# EAGLE design SignalGenerator (EAGLE 6.5.0)
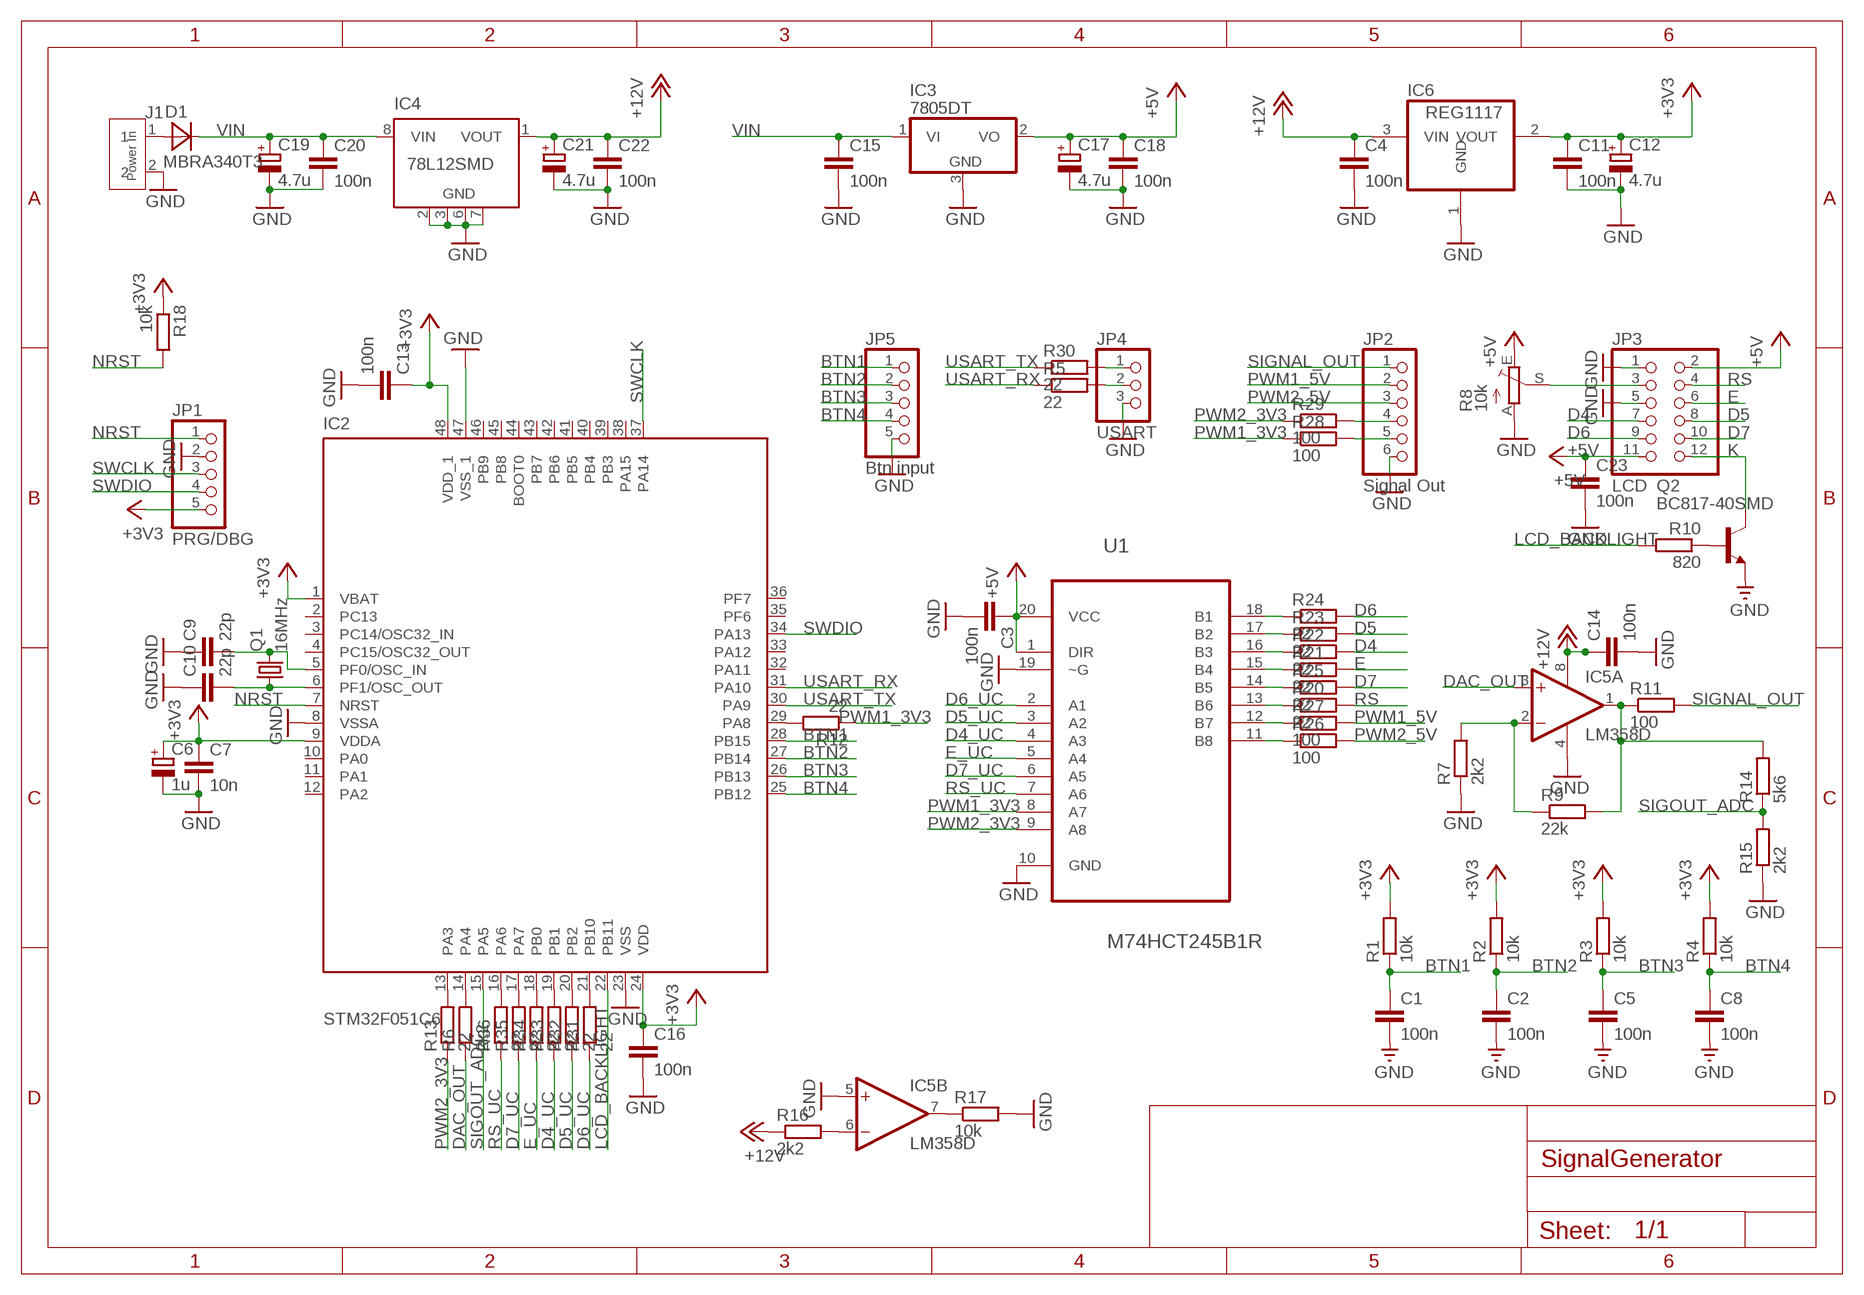
[diagram p0: schematic, sheet 1]

## Parts
C1  100n  C-EUC0805  [C0805]
C2  100n  C-EUC0805  [C0805]
C3  100n  C-EUC0805  [C0805]
C4  100n  C-EUC0805  [C0805]
C5  100n  C-EUC0805  [C0805]
C6  1u  CPOL-EUA/3216-18W  [A/3216-18W]
C7  10n  C-EUC0805  [C0805]
C8  100n  C-EUC0805  [C0805]
C9  22p  C-EUC0603  [C0603]
C10  22p  C-EUC0603  [C0603]
C11  100n  C-EUC0805  [C0805]
C12  4.7u  CPOL-EUA  [PANASONIC_A]
C13  100n  C-EUC0805  [C0805]
C14  100n  C-EUC0805  [C0805]
C15  100n  C-EUC0805  [C0805]
C16  100n  C-EUC0805  [C0805]
C17  4.7u  CPOL-EUB  [PANASONIC_B]
C18  100n  C-EUC0805  [C0805]
C19  4.7u  CPOL-EUB  [PANASONIC_B]
C20  100n  C-EUC0805  [C0805]
C21  4.7u  CPOL-EUA  [PANASONIC_A]
C22  100n  C-EUC0805  [C0805]
C23  100n  C-EUC0805  [C0805]
D1  MBRA340T3  [SMA]
IC2  STM32F051C6  [LQFP48-7X7]
IC3  7805DT  [TO252]
IC4  78L12SMD  [SO08]
IC5  LM358D  [SO08]
IC6  REG1117  [SOT223]
J1  Power In  SCREW-TERMINAL-2P'5.08'  [2P-5.08]
JP1  PRG/DBG  PINHD-1X5  [1X05]
JP2  Signal Out  PINHD-1X6  [1X06]
JP3  LCD  PINHD-2X6  [2X06]
JP4  USART  PINHD-1X3  [1X03]
JP5  Btn input  PINHD-1X5  [1X05]
Q1  16MHz  SMD_CRYSTAL  [SMD_CRYSTAL]
Q2  BC817-40SMD  [SOT23-BEC]
R1  10k  R-EU_R0603  [R0603]
R2  10k  R-EU_R0603  [R0603]
R3  10k  R-EU_R0603  [R0603]
R4  10k  R-EU_R0603  [R0603]
R5  22  R-EU_R0603  [R0603]
R6  2k2  R-EU_R0603  [R0603]
R7  2k2  R-EU_R0603  [R0603]
R8  10k  TRIM_EU-B25P  [B25P]
R9  22k  R-EU_R0603  [R0603]
R10  820  R-EU_R0603  [R0603]
R11  100  R-EU_R0603  [R0603]
R12  22  R-EU_R0603  [R0603]
R13  22  R-EU_R0603  [R0603]
R14  5k6  R-EU_R0603  [R0603]
R15  2k2  R-EU_R0603  [R0603]
R16  2k2  R-EU_R0603  [R0603]
R17  10k  R-EU_R0603  [R0603]
R18  10k  R-EU_R0603  [R0603]
R20  22  R-EU_R0603  [R0603]
R21  22  R-EU_R0603  [R0603]
R22  22  R-EU_R0603  [R0603]
R23  22  R-EU_R0603  [R0603]
R24  22  R-EU_R0603  [R0603]
R25  22  R-EU_R0603  [R0603]
R26  100  R-EU_R0603  [R0603]
R27  100  R-EU_R0603  [R0603]
R28  100  R-EU_R0603  [R0603]
R29  100  R-EU_R0603  [R0603]
R30  22  R-EU_R0603  [R0603]
R31  22  R-EU_R0603  [R0603]
R32  22  R-EU_R0603  [R0603]
R33  22  R-EU_R0603  [R0603]
R34  22  R-EU_R0603  [R0603]
R35  22  R-EU_R0603  [R0603]
R36  22  R-EU_R0603  [R0603]
U1  M74HCT245B1R  [DIP254P762X393-20]

## Nets
+3V3: C6.+ C7.1 C11.1 C12.+ C13.1 C16.1 IC2.1(VBAT) IC2.9(VDDA) IC2.24(VDD) IC2.48(VDD_1) IC6.2(VOUT) JP1.5 R1.2 R2.2 R3.2 R4.2 R18.1
+5V: C3.1 C17.+ C18.1 C23.1 IC3.2(VO) JP3.2 JP3.11 R8.E U1.1(DIR) U1.20(VCC)
+12V: C4.1 C14.1 C21.+ C22.1 IC4.1(VOUT) IC5.8(P:V+) IC6.3(VIN) R16.1
BTN1: C1.1 IC2.28(PB15) JP5.1 R1.1
BTN2: C2.1 IC2.27(PB14) JP5.2 R2.1
BTN3: C5.1 IC2.26(PB13) JP5.3 R3.1
BTN4: C8.1 IC2.25(PB12) JP5.4 R4.1
D4: JP3.7 R22.2
D4_UC: R33.1 U1.4(A3)
D5: JP3.8 R23.2
D5_UC: R32.1 U1.3(A2)
D6: JP3.9 R24.2
D6_UC: R31.1 U1.2(A1)
D7: JP3.10 R25.2
D7_UC: R35.1 U1.6(A5)
DAC_OUT: IC5.3(A:+IN) R6.1
E: JP3.6 R21.2
E_UC: R34.1 U1.5(A4)
GND: C1.2 C2.2 C3.2 C4.2 C5.2 C6.- C7.2 C8.2 C9.1 C10.1 C11.2 C12.- C13.2 C14.2 C15.2 C16.2 C17.- C18.2 C19.- C20.2 C21.- C22.2 C23.2 IC2.8(VSSA) IC2.23(VSS) IC2.47(VSS_1) IC3.3(GND) IC4.2(GND) IC4.3(GND) IC4.6(GND) IC4.7(GND) IC5.4(P:V-) IC5.5(B:+IN) IC6.1(GND) J1.2 JP1.2 JP2.6 JP3.1 JP3.5 JP4.3 JP5.5 Q2.E R7.1 R8.A R15.1 R17.2 U1.10(GND) U1.19(~G)
K: JP3.12 Q2.C
LCD_BACKLIGHT: IC2.22(PB11) R10.2
N$1: C10.2 IC2.6(PF1/OSC_OUT) Q1.1
N$2: C9.2 IC2.5(PF0/OSC_IN) Q1.2
N$3: JP3.3 R8.S
N$5: Q2.B R10.1
N$6: IC5.2(A:-IN) R7.2 R9.1
N$7: IC2.14(PA4) R6.2
N$8: IC5.1(A:OUT) R9.2 R11.1 R14.2
N$9: IC2.29(PA8) R12.2
N$10: IC2.13(PA3) R13.2
N$11: JP2.5 R28.2
N$12: JP2.4 R29.2
N$13: IC2.16(PA6) R36.2
N$14: IC2.17(PA7) R35.2
N$15: IC2.18(PB0) R34.2
N$16: IC2.19(PB1) R33.2
N$17: R20.1 U1.13(B6)
N$18: R21.1 U1.15(B4)
N$19: R22.1 U1.16(B3)
N$20: R23.1 U1.17(B2)
N$21: R24.1 U1.18(B1)
N$22: R26.1 U1.11(B8)
N$23: R27.1 U1.12(B7)
N$24: R25.1 U1.14(B5)
N$25: JP4.1 R30.2
N$26: JP4.2 R5.2
N$28: IC2.20(PB2) R32.2
N$29: IC2.21(PB10) R31.2
N$30: D1.A J1.1
N$31: IC5.6(B:-IN) R16.2
N$32: IC5.7(B:OUT) R17.1
NRST: IC2.7(NRST) JP1.1 R18.2
PWM1_3V3: R12.1 R28.1 U1.8(A7)
PWM1_5V: JP2.2 R27.2
PWM2_3V3: R13.1 R29.1 U1.9(A8)
PWM2_5V: JP2.3 R26.2
RS: JP3.4 R20.2
RS_UC: R36.1 U1.7(A6)
SIGNAL_OUT: JP2.1 R11.2
SIGOUT_ADC: IC2.15(PA5) R14.1 R15.2
SWCLK: IC2.37(PA14) JP1.3
SWDIO: IC2.34(PA13) JP1.4
USART_RX: IC2.31(PA10) R5.1
USART_TX: IC2.30(PA9) R30.1
VIN: C15.1 C19.+ C20.1 D1.C IC3.1(VI) IC4.8(VIN)
Unconnected: IC2.2(PC13) IC2.3(PC14/OSC32_IN) IC2.4(PC15/OSC32_OUT) IC2.10(PA0) IC2.11(PA1) IC2.12(PA2) IC2.32(PA11) IC2.33(PA12) IC2.35(PF6) IC2.36(PF7) IC2.38(PA15) IC2.39(PB3) IC2.40(PB4) IC2.41(PB5) IC2.42(PB6) IC2.43(PB7) IC2.44(BOOT0) IC2.45(PB8) IC2.46(PB9) IC4.4(NC) IC4.5(NC)

## Library data of the parts
C1-C5 C7-C11 C13-C16 C18 C20 C22 C23 = resistor:C-EU: CAPACITOR, European symbol
C6 C12 C17 C19 C21 = resistor:CPOL-EU: POLARIZED CAPACITOR, European symbol
D1 = diode:MBRA340T3: Surface Mount Schottky Power Rectifier Source: http://www.onsemi.com/pub_link/Collateral/MBRA340T3-D.PDF
IC2 = CarReceiver:STM32F051C6
IC3 = linear:78*: Positive VOLTAGE REGULATOR Source: http://cache.national.com/ds/LM/LM78L05.pdf http://www.fairchildsemi.com/ds/LM/LM7805.pdf
IC4 = linear:78L*SMD: Positive VOLTAGE REGULATOR
IC5 = linear:LM358: OP AMP also LM158; LM258; LM2904 Source: http://cache.national.com/ds/LM/LM158.pdf
IC6 = burr-brown:REG1117: 800mA and 1A Low Dropout (LDO) Positive Regulator 1.8V, 2.5V, 2.85V, 3.3V, 5V, and Adj; MPN: REG1117; OC_FARNELL: 1097566; OC_NEWARK: 14P6981
J1 = SeeedStudio-Connector:SCREW-TERMINAL-2P
JP1 JP5 = pinhead:PINHD-1X5: PIN HEADER
JP2 = pinhead:PINHD-1X6: PIN HEADER
JP3 = pinhead:PINHD-2X6: PIN HEADER
JP4 = pinhead:PINHD-1X3: PIN HEADER
Q1 = CarReceiver:SMD_CRYSTAL
Q2 = CarReceiver:BC817*: NPN Transistor
R1-R7 R9-R18 R20-R36 = resistor:R-EU_: RESISTOR, European symbol
R8 = pot:TRIM_EU-: POTENTIOMETER
U1 = ST Microelctronics_By_element14_Batch_1:M74HCT245B1R: OCTAL BUS TRANSCEIVER; MPN: M74HCT245B1R; OC_FARNELL: 1282842; OC_NEWARK: 89K0835; PACKAGE: PDIP-20; SUPPLIER: STMICROELECTRONICS

## Board
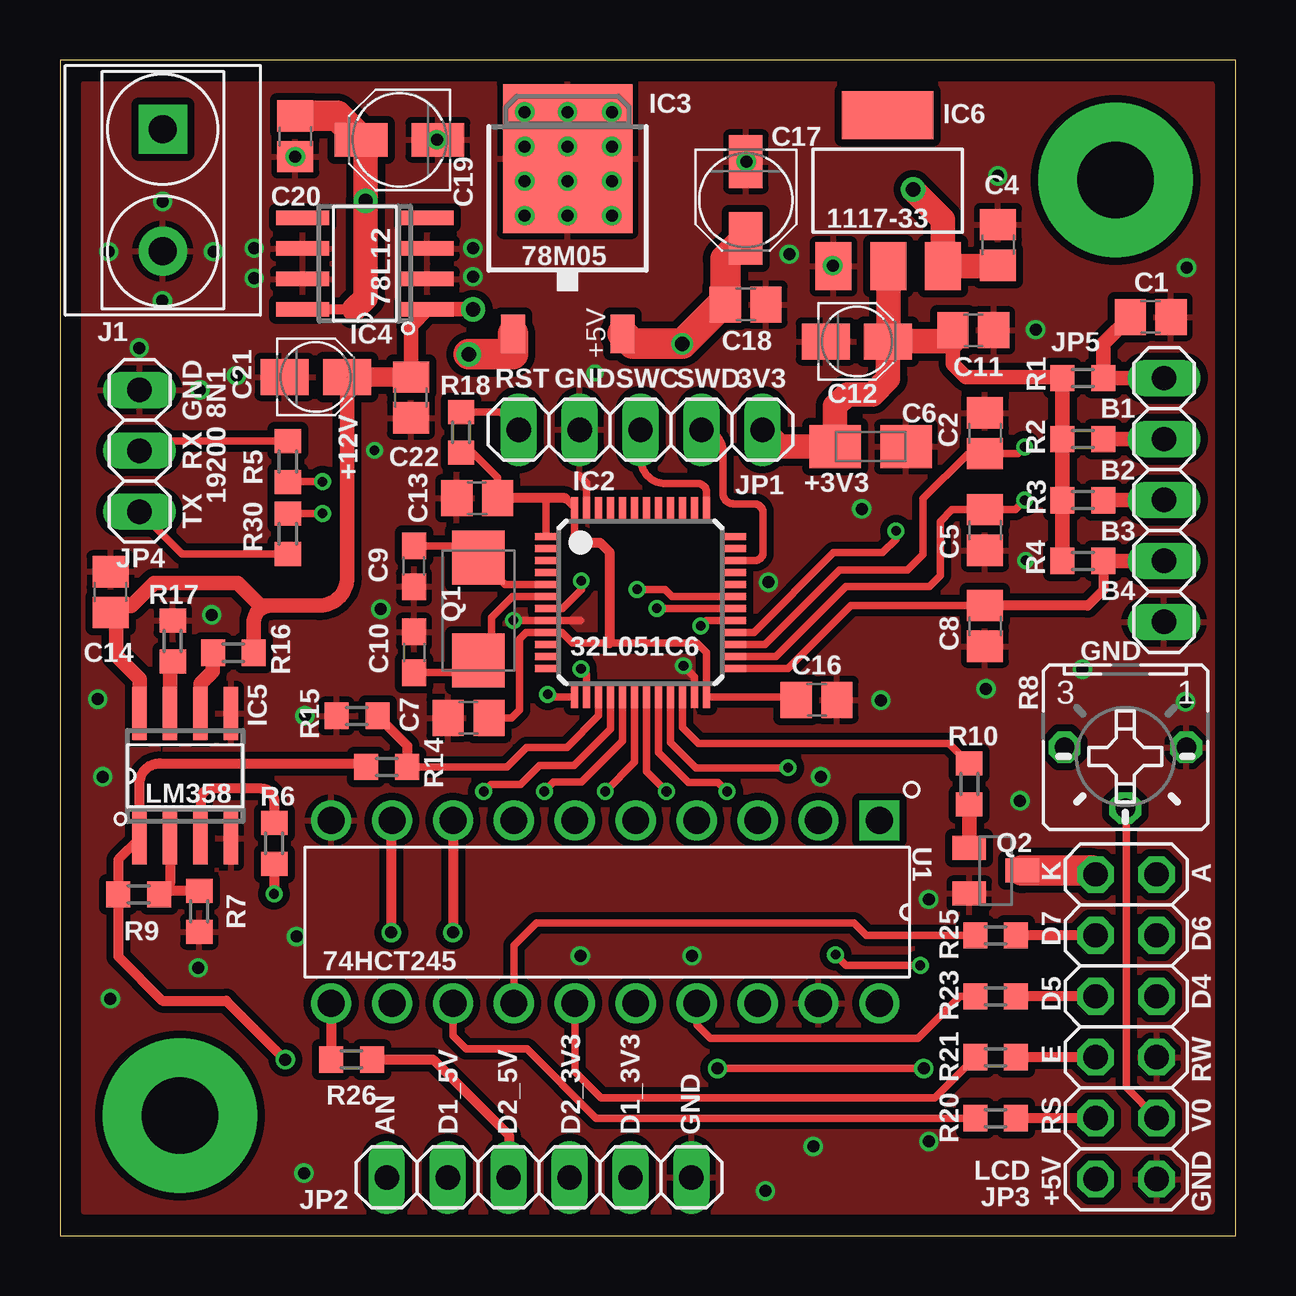
[diagram p1: board, top side]
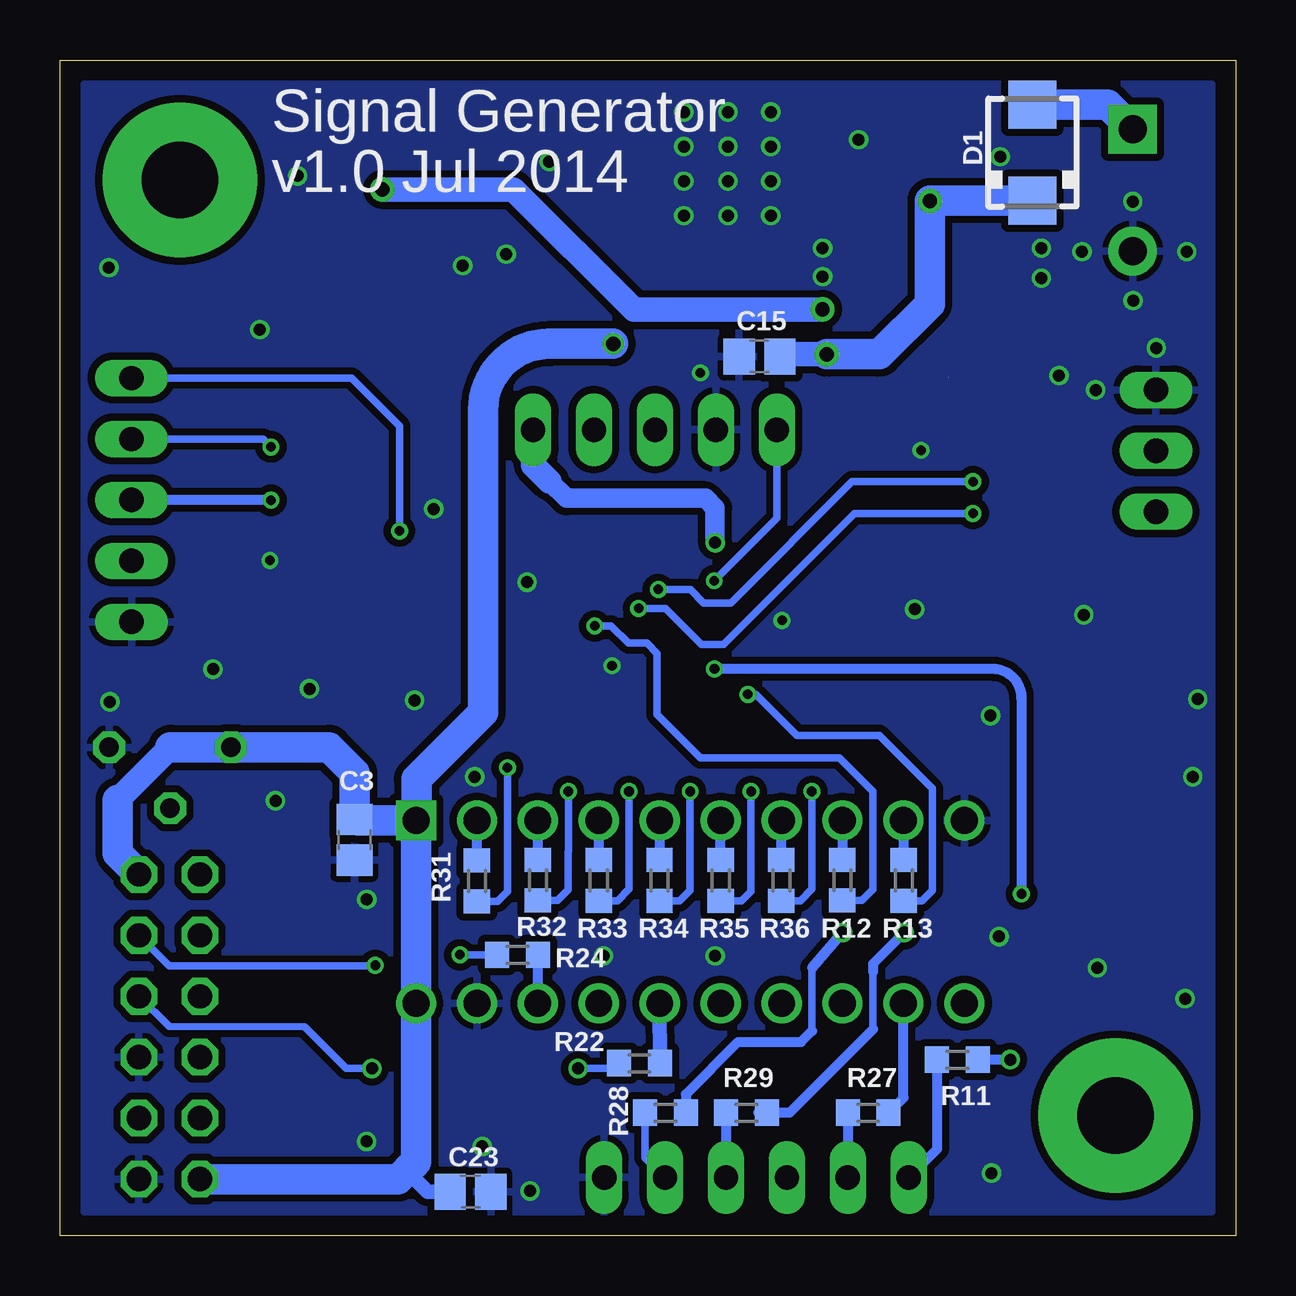
[diagram p2: board, bottom side, seen from below]

Size 49 x 49 mm. Coordinates in mm from the lower left corner, seen from the top.
Outline: 0,0 49,0 49,49 0,49 0,0
Copper layers (1*16): Top 0.035mm / dielectric 1.5mm / Bottom 0.035mm
Design rules "SeeedStudio_2layer_DRU_no_angle_20140221": minimum track width 6mil, minimum drill 12mil, track to track 6mil, track to pad 6mil, pad to pad 6mil, via to via 6mil, smd to smd 0mil, copper to edge 10mil, drill to drill 10mil, minimum pad ring 10mil, minimum via ring 6mil, stop-mask expansion 2mil, vias tented up to drill 100mil, thermal gap 10mil

### Footprints (pad centres in the part's own frame; a part is rotated, then mirrored left to right if it is on the bottom)
C0805 = smd 1.3 x 1.5: 1 -0.85,0; 2 0.85,0
A/3216-18W = smd 2.15 x 1.8: + 1.475,0; - -1.475,0
C0603 = smd 1.1 x 1: 1 -0.85,0; 2 0.85,0
PANASONIC_A = smd 2 x 1.5: + 1.3,0; - -1.3,0
PANASONIC_B = smd 2.2 x 1.4: + 1.6,0; - -1.6,0
SMA = smd 2 x 2: A 2,0; C -2,0
LQFP48-7X7 = smd 0.9 x 0.3: 1 -3.95,2.75; 2 -3.95,2.25; 3 -3.95,1.75; 4 -3.95,1.25; 5 -3.95,0.75; 6 -3.95,0.25; 7 -3.95,-0.25; 8 -3.95,-0.75; 9 -3.95,-1.25; 10 -3.95,-1.75; 11 -3.95,-2.25; 12 -3.95,-2.75; 25 3.95,-2.75; 26 3.95,-2.25; 27 3.95,-1.75; 28 3.95,-1.25; 29 3.95,-0.75; 30 3.95,-0.25; 31 3.95,0.25; 32 3.95,0.75; 33 3.95,1.25; 34 3.95,1.75; 35 3.95,2.25; 36 3.95,2.75 | smd 0.3 x 0.9: 13 -2.75,-3.95; 14 -2.25,-3.95; 15 -1.75,-3.95; 16 -1.25,-3.95; 17 -0.75,-3.95; 18 -0.25,-3.95; 19 0.25,-3.95; 20 0.75,-3.95; 21 1.25,-3.95; 22 1.75,-3.95; 23 2.25,-3.95; 24 2.75,-3.95; 37 2.75,3.95; 38 2.25,3.95; 39 1.75,3.95; 40 1.25,3.95; 41 0.75,3.95; 42 0.25,3.95; 43 -0.25,3.95; 44 -0.75,3.95; 45 -1.25,3.95; 46 -1.75,3.95; 47 -2.25,3.95; 48 -2.75,3.95
TO252 = smd 1 x 1.6: 1 -2.28,-4.8; 2 2.28,-4.8 | smd 5.4 x 6.2: 3 0,2.5
SO08 = smd 0.6 x 2.2: 1 -1.905,-2.6; 2 -0.635,-2.6; 3 0.635,-2.6; 4 1.905,-2.6; 5 1.905,2.6; 6 0.635,2.6; 7 -0.635,2.6; 8 -1.905,2.6
SOT223 = smd 1.499 x 2.007: 1 -2.261,-3.15; 2 0.025,-3.15; 3 2.311,-3.15 | smd 3.81 x 2.007: 4 0,3.15
2P-5.08 = drill 1.168 pad 2.032 square: 1 0,2.54 | drill 1.168 pad 2.032: 2 0,-2.54
1X05 = drill 1.016 long: 1 -5.08,0; 2 -2.54,0; 3 0,0; 4 2.54,0; 5 5.08,0
1X06 = drill 1.016 long: 1 -6.35,0; 2 -3.81,0; 3 -1.27,0; 4 1.27,0; 5 3.81,0; 6 6.35,0
2X06 = drill 1.016 octagon: 1 -6.35,-1.27; 2 -6.35,1.27; 3 -3.81,-1.27; 4 -3.81,1.27; 5 -1.27,-1.27; 6 -1.27,1.27; 7 1.27,-1.27; 8 1.27,1.27; 9 3.81,-1.27; 10 3.81,1.27; 11 6.35,-1.27; 12 6.35,1.27
1X03 = drill 1.016 long: 1 -2.54,0; 2 0,0; 3 2.54,0
SMD_CRYSTAL = smd 2.25 x 2.2: 1 -2.15,0; 2 2.15,0
SOT23-BEC = smd 1 x 1.4: B -0.95,-1.1; C 0,1.1; E 0.95,-1.1
R0603 = smd 1 x 1.1: 1 -0.85,0; 2 0.85,0
B25P = drill 0.813 octagon: A -2.54,0; E 2.54,0; S 0,2.54
DIP254P762X393-20 = drill 1.118 square: 1 -7.62,22.86 | drill 1.118: 2 -7.62,20.32; 3 -7.62,17.78; 4 -7.62,15.24; 5 -7.62,12.7; 6 -7.62,10.16; 7 -7.62,7.62; 8 -7.62,5.08; 9 -7.62,2.54; 10 -7.62,0; 11 0,0; 12 0,2.54; 13 0,5.08; 14 0,7.62; 15 0,10.16; 16 0,12.7; 17 0,15.24; 18 0,17.78; 19 0,20.32; 20 0,22.86

### Placement (x,y rotation side)
C1  45.46,38.29 0 top
C2  38.56,33.44 90 top
C3  36.72,16.5 270 bottom
C4  39.1,41.29 90 top
C5  38.56,29.41 270 top
C6  33.79,32.88 180 top
C7  17.03,21.58 180 top
C8  38.56,25.41 270 top
C9  14.75,27.9 90 top
C10  14.76,24.31 270 top
C11  38.07,37.73 0 top
C12  33.22,37.27 0 top
C13  17.39,30.73 180 top
C14  2.11,26.82 90 top
C15  19.84,36.64 180 bottom
C16  31.54,22.33 0 top
C17  28.59,43.16 270 top
C18  28.58,38.81 0 top
C19  14.15,45.67 180 top
C20  9.81,45.82 270 top
C21  10.66,35.79 0 top
C22  14.63,34.93 270 top
C23  31.89,1.83 0 bottom
D1  8.47,45.14 90 bottom
IC2  24.2,26.39 0 top
IC3  21.16,42.39 0 top
IC4  12.71,40.51 90 top
IC5  5.22,19.16 0 top
IC6  34.5,43.55 0 top
J1  4.29,43.57 0 top
JP1  24.2,33.59 0 top
JP2  19.97,2.42 0 top
JP3  44.44,8.7 90 top
JP4  3.32,32.71 90 top
JP5  46.02,30.66 270 top
Q1  17.44,26.11 90 top
Q2  39,15.21 270 top
R1  42.64,35.74 180 top
R2  42.64,33.2 180 top
R3  42.64,30.65 180 top
R4  42.64,28.12 180 top
R5  9.5,32.26 90 top
R6  8.93,16.35 270 top
R7  5.81,13.51 90 top
R8  44.41,20.35 180 top
R9  3.28,14.22 180 top
R10  37.9,18.82 90 top
R11  11.59,7.33 180 bottom
R12  16.39,14.81 270 bottom
R13  13.83,14.8 270 bottom
R14  13.62,19.53 180 top
R15  12.38,21.66 0 top
R16  7.23,24.29 180 top
R17  4.7,24.78 90 top
R18  16.72,33.48 90 top
R20  39,4.89 0 top
R21  39,7.43 0 top
R22  24.85,7.18 180 bottom
R23  39,9.97 0 top
R24  29.93,11.7 180 bottom
R25  39,12.51 0 top
R26  12.15,7.34 0 top
R27  15.31,5.12 180 bottom
R28  23.76,5.12 180 bottom
R29  20.39,5.12 180 bottom
R30  9.5,29.25 270 top
R31  31.62,14.78 270 bottom
R32  29.08,14.81 270 bottom
R33  26.54,14.8 270 bottom
R34  24.01,14.8 270 bottom
R35  21.46,14.8 270 bottom
R36  18.93,14.8 270 bottom
U1  11.3,9.68 270 top

### Tracks (layer width: path | path; a pad name or v marks a point on that pad's centre or on a via)
+3V3  (via drill 0.5)
  Top 0.305: 21.45,29.12 IC2.48 21.06,30.73 | C7.1 18.82,21.58 19.15,21.91 19.15,24.87 19.42,25.14 IC2.9 20.92,25.14 21.37,24.69 22.89,24.69 26.56,24.69 26.95,24.3 IC2.24 30.6,22.44 C16.1 | R18.1 17.2,32.63 18.24,31.59 C13.1 | IC2.1 20.25,30.73
  Top 0.406: 21.45,29.12 v21.69,28.88 22.51,28.88 22.9,28.49 22.9,24.7 22.89,24.69 | 21.06,30.73 20.25,30.73 C13.1
  Top 0.61: C11.1 37.22,36.32 37.75,35.79 41.74,35.79 R1.2 R2.2 R3.2 R4.2
  Top 0.813: C12.+
  Top 1.016: IC6.2 C12.+ | C12.+ 34.52,35.71 33.87,35.06 32.8,35.06 32.31,34.57 C6.+ 29.99,32.88 JP1.5 | C12.+ 37.22,37.27 C11.1
  Bottom 0.813: v21.69,28.88 21.69,30.32 22.1,30.73 27.89,30.73 28.59,31.43
  Bottom 1.016: 28.59,31.43 29.28,32.12 JP1.5
+5V  (via drill 0.6)
  Top 1.016: 27.58,38.81 C18.1
  Top 1.27: IC3.2 23.86,37.17 v25.94,37.17 27.58,38.81 | C17.+ 27.73,40.7 C18.1
  Bottom 0.61: C23.1 33.69,1.83 34.55,2.69
  Bottom 1.016: 34.14,17.32 U1.1 | 46.59,18.16 44.4,20.35 | 36.58,17.3 C3.1
  Bottom 1.27: v25.94,37.17 28.61,37.17 arc-90 31.36,34.42 31.36,21.81 34.14,19.03 34.14,17.32 | JP3.2 34.9,2.35 34.55,2.69 34.16,3.08 U1.20 U1.1 36.58,17.3 | 44.4,20.35 R8.E 37.78,20.35 36.71,19.28 C3.1 | 46.59,18.16 46.59,15.93 JP3.11
+12V  (via drill 0.6 pad 1.02)  (1 unrouted)
  Top 0.406: 14.73,35.78 C22.1
  Top 0.61: v17.21,38.6 arc-90 v17.22,38.6 v17.21,38.6 | C21.+ 11.97,27.42 arc-90 10.81,26.26 8.78,26.26 | C22.1 14.63,37.92 IC4.1 v17.21,38.6 | 12,35.75 arc90 C21.+ | 8.78,26.26 arc90 8.08,25.56 R16.1 | 8.78,26.26 8.34,26.26 7.4,27.2 3.93,27.2 2.97,26.24 2.38,26.24 C14.1 | 2.35,26.24 C14.1 | IC5.8 3.31,23.2 2.34,24.17 2.34,25.74 C14.1
  Top 0.813: C22.1 C21.+
  Top 1.016: C4.1 39.06,40.4 IC6.3 36.81,42.35 v35.56,43.6
  Bottom 1.016: v35.56,43.6 30.09,43.6 25.08,38.59 v17.23,38.59 v17.22,38.6
BTN1  (via drill 0.4)
  Top 0.305: IC2.28 28.92,25.14 32.24,28.46 34.29,28.46 34.85,29.02 v34.85,29.37
  Top 0.61: JP5.1 R1.1 43.49,37.17 C1.1
  Bottom 0.305: JP5.1 38.07,35.74 38.06,35.73 36.84,35.73 34.85,33.74 v34.85,29.37
BTN2  (via drill 0.4)
  Top 0.305: IC2.27 29.38,24.64 32.48,27.74 35.33,27.74 35.97,28.38 35.97,30.71 37.82,32.56 38.53,32.56 C2.1 39.93,32.59 v40.21,32.87
  Top 0.61: JP5.2 R2.1
  Bottom 0.305: v40.21,32.87 40.54,33.2 JP5.2
BTN3  (via drill 0.4)
  Top 0.305: IC2.26 29.84,24.14 32.75,27.05 36.23,27.05 36.69,27.51 36.69,29.77 37.18,30.26 C5.1 39.82,30.26 v40.21,30.65
  Top 0.61: JP5.3 R3.1
  Bottom 0.406: v40.21,30.65 JP5.3
BTN4
  Top 0.305: IC2.25 30.34,23.64 32.96,26.26 C8.1
  Top 0.406: R4.1 43.49,26.91 42.84,26.26 C8.1
  Top 0.61: JP5.4 R4.1
D4  (via drill 0.5)
  Top 0.305: v36,6.96 v27.41,6.96
  Bottom 0.305: JP3.7 44.44,8.71 38.81,8.7 37.07,6.96 v36,6.96 | v27.41,6.96 25.92,6.96 R22.2
D4_UC
  Bottom 0.406: R33.1 U1.4
D5
  Top 0.406: JP3.8 R23.2
D5_UC
  Bottom 0.406: R32.1 U1.3
D6  (via drill 0.4)
  Top 0.305: v35.86,11.26 32.77,11.26 v32.33,11.7
  Bottom 0.305: JP3.9 44.44,11.25 v35.87,11.25 arc-90 v35.86,11.26 | R24.2 v32.33,11.7
D6_UC
  Bottom 0.406: R31.1 U1.2
D7
  Top 0.406: JP3.10 R25.2
D7_UC
  Bottom 0.406: R35.1 U1.6
DAC_OUT
  Top 0.406: R6.1 8.93,18.1 arc90 8.4,18.63 6.35,18.63 arc90 5.86,18.14 IC5.3 arc-90 IC5.3
E
  Top 0.406: JP3.6 R21.2
E_UC
  Bottom 0.406: R34.1 U1.5
GND  (via drill 0.4, 0.5)
  Top 0.305: IC2.47 21.95,31.39 21.66,31.68 | 21.69,25.64 IC2.8 v18.9,25.64 | IC2.23 26.45,23.29 v25.99,23.75
  Top 0.406: IC5.5
  other vias: 8.09,41.16 8.09,39.91 17.21,41.16 17.21,39.97 19.37,45.39 21.16,45.39 23,45.39 19.37,43.95 21.16,43.95 23,43.95 19.37,42.51 21.16,42.51 23,42.51 32.21,40.43 29.41,1.86 31.4,3.71 36.22,3.92 36.21,14.01 26.34,11.66 21.69,11.66 2.1,9.87 5.76,11.16 1.78,19.12 1.57,22.36 10.17,2.6 13.11,32.73 28.61,44.77 40.67,37.76 42.62,23.61 34.22,22.31 5.83,35.25 15.71,45.68 31.71,19.12 29.53,27.23 33.42,30.29 40.02,18.12 13.37,26.11 39.09,44.17 2.03,41.01 9.81,44.97 4.27,38.97 6.4,41.01 4.28,43.1 30.4,40.91 38.6,22.79 46.92,22.25 9.86,12.46 3.3,37 7.36,35.84 46.96,40.34 40.25,28.14 22.31,35.96 10.21,21.67 6.32,25.87 19.37,46.83 21.16,46.83 23,46.83
  pour Top (isolate 0.3): 1,1 1,48 48,48 48,1
  pour Bottom (isolate 0.3): 1,1 48,1 48,48 1,48
K
  Top 1.27: JP3.12 43.01,15.21 Q2.C
LCD_BACKLIGHT
  Top 0.305: IC2.22 25.95,21.17 26.61,20.51 37.06,20.51 R10.2
N$1
  Top 0.305: IC2.6 18.87,26.64 17.99,25.76 17.99,24.51 Q1.1 16.94,23.46 C10.2
N$2
  Top 0.305: IC2.5 18.56,27.14 Q1.2 16.95,28.75 C9.2
N$3
  Top 0.305: JP3.3 44.44,6.17 44.44,17.78 R8.S
N$4  (via drill 3.2 pad 6.45)
  other vias: 5,5
N$5
  Top 0.61: R10.1 Q2.B
N$6
  Top 0.406: IC5.2 4.58,14.68 R9.1 4.27,14.36 R7.2
N$7  (via drill 0.4)
  Top 0.305: IC2.14 21.95,23.39 v21.72,23.62
  Top 0.406: R6.2 v8.92,14.24
  Bottom 0.305: v21.71,23.63 v21.72,23.62
  Bottom 0.406: v21.71,23.63 10.14,23.63 arc90 8.93,22.42 v8.93,14.25 arc-90 v8.92,14.24
N$8  (via drill 0.5)
  Top 0.406: R14.2 arc90 12.62,19.68 4.16,19.68 arc90 3.31,18.84 IC5.1 2.43,15.68 R9.2 2.43,11.63 4.27,9.79 6.93,9.79 v9.39,7.33
  Bottom 0.406: v9.39,7.33 R11.1
N$9  (via drill 0.4)
  Top 0.305: IC2.29 26.94,25.64 v26.71,25.41
  Bottom 0.305: R12.2 15.58,13.96 15.12,14.42 15.12,18.51 16.52,19.91 22.3,19.91 24.11,21.72 24.11,24.26 24.54,24.69 25.31,24.69 26.03,25.41 v26.71,25.41
N$10  (via drill 0.4)
  Top 0.305: IC2.13 20.45,22.44 v20.33,22.56
  Bottom 0.305: R13.2 13.07,13.95 12.63,14.39 12.63,18.63 14.85,20.85 18.29,20.85 20,22.56 v20.33,22.56
N$11
  Bottom 0.305: JP2.5 24.61,3.25 R28.2
N$12
  Bottom 0.406: R29.2 JP2.4
N$13  (via drill 0.4)
  Top 0.305: IC2.16 22.95,21.12 21.43,19.6 19.99,19.6 19.2,18.81 17.96,18.81 v17.66,18.51
  Bottom 0.305: R36.2 18.14,13.95 17.65,14.44 17.65,18.58 17.66,18.59 v17.66,18.51
N$14  (via drill 0.4)
  Top 0.305: IC2.17 23.45,20.62 21.73,18.9 20.58,18.9 v20.19,18.51
  Bottom 0.305: R35.2 20.59,13.95 20.19,14.35 v20.19,18.51
N$15  (via drill 0.4)
  Top 0.305: IC2.18 23.95,19.73 v22.73,18.51
  Bottom 0.305: R34.2 23.17,13.95 22.73,14.39 v22.73,18.51
N$16  (via drill 0.4)
  Top 0.305: IC2.19 24.45,19.34 v25.28,18.51
  Bottom 0.305: R33.2 25.77,13.95 25.28,14.44 v25.28,18.51
N$17
  Top 0.305: U1.13 16.38,8.33 16.93,7.78 19.46,7.78 22.35,4.89 R20.1
N$18
  Top 0.305: U1.15 21.47,6.83 22.56,5.74 36.46,5.74 R21.1
N$19
  Bottom 0.61: U1.16 R22.1
N$20
  Top 0.305: R23.1 37.51,9.97 35.76,8.22 27.12,8.22 26.55,8.79 U1.17
N$21
  Bottom 0.406: U1.18 R24.1
N$22
  Top 0.406: U1.11 R26.1
N$23
  Bottom 0.406: U1.12 13.84,5.74 R27.1
N$24
  Top 0.305: R25.1 33.62,12.51 33.09,13.04 19.86,13.04 18.92,12.1 U1.14
N$25
  Top 0.305: R30.2 5.09,28.4 JP4.1
N$26
  Top 0.305: 9.48,33.11 R5.2 3.72,33.11 JP4.2
N$27  (via drill 3.2 pad 6.45)
  other vias: 44,44
N$28  (via drill 0.4)
  Top 0.305: IC2.20 24.95,20.13 26.19,18.89 27.43,18.89 v27.81,18.51
  Bottom 0.305: R32.2 28.26,13.96 27.82,14.4 27.82,16 27.81,16.01 v27.81,18.51
N$29  (via drill 0.4)
  Top 0.305: IC2.21 25.45,20.56 26.51,19.5 v30.35,19.5
  Bottom 0.305: R31.2 30.77,13.93 30.35,14.35 v30.35,19.5
N$30
  Bottom 1.27: J1.1 5.32,47.14 D1.A
N$31
  Top 0.61: IC5.6 5.86,23 6.37,23.52 R16.2
N$32
  Top 0.61: IC5.7 4.58,23.82 R17.1
NRST  (via drill 0.4)
  Top 0.305: IC2.7 20.95,26.14 21.73,26.92 v21.73,27.29 | R18.2 18.38,34.33 JP1.1
  Bottom 0.305: v21.73,27.29 19.12,29.9 JP1.1
PWM1_3V3  (via drill 0.5)
  Top 0.406: U1.8 v16.38,12.63
  Bottom 0.305: 17.65,11.16 17.65,8.53
  Bottom 0.406: U1.8 R12.1 | v16.38,12.63 17.65,11.16 | 17.65,8.53 18.11,8.07 20.73,8.07 22.91,5.89 R28.1
PWM1_5V
  Bottom 0.406: R27.2 JP2.2
PWM2_3V3  (via drill 0.5)
  Top 0.406: U1.9 13.81,17.27 v13.81,12.63
  Bottom 0.305: 15.11,11.01 15.11,8.6
  Bottom 0.406: U1.9 R13.1 | v13.81,12.63 15.11,11.33 15.11,11.01 | 19.9,5.13 R29.1 18.59,5.12 15.11,8.6
PWM2_5V
  Top 0.406: R26.2 15.55,7.34 18.71,4.18 JP2.3
RS
  Top 0.406: JP3.4 R20.2
RS_UC
  Bottom 0.406: R36.1 U1.7
SIGNAL_OUT
  Bottom 0.406: R11.2 12.44,3.6 JP2.1
SIGOUT_ADC
  Top 0.305: IC2.15 22.45,21.67 21.13,20.35 19.45,20.35 18.63,19.53 R14.1
  Top 0.406: R15.2 14.47,20.42 R14.1
SWCLK
  Top 0.305: JP1.3 24.2,32.39 arc90 25.25,31.34 26.6,31.34 arc-90 26.95,30.99 IC2.37
SWDIO
  Top 0.305: IC2.34 28.97,28.14 arc90 29.31,28.48 29.31,30.11 arc90 28.92,30.5 28.07,30.5 arc-90 27.63,30.94 27.63,32.7 arc90 JP1.4
USART_RX  (via drill 0.4)
  Top 0.305: v24.06,26.93 25.22,26.93 25.51,26.64 IC2.31 | v10.94,31.42 R5.1
  Bottom 0.305: v24.06,26.93 22.72,26.93 22.17,26.37 21.04,26.37 15.99,31.42 v10.94,31.42
USART_TX  (via drill 0.4)
  Top 0.305: IC2.30 v24.88,26.14 | R30.1 v10.94,30.1
  Bottom 0.305: v24.88,26.14 23.77,26.14 22.27,24.64 21.34,24.64 15.88,30.1 v10.94,30.1
VIN  (via drill 0.6 pad 1.02)
  Top 0.406: IC4.8 12.27,38.6 | 12.72,45.5 C19.+
  Top 1.016: 12.74,45.48 v12.74,43.13 12.74,39.08 12.27,38.6
  Top 1.27: C20.1 11.55,46.67 C19.+ | v17.04,36.73 18.88,36.73 IC3.1 | 12.72,45.5 12.74,45.48
  Bottom 1.016: v17.04,36.73 18.9,36.73 C15.1
  Bottom 1.27: v17.04,36.73 14.84,36.73 12.74,38.83 v12.74,43.13 v12.73,43.14 D1.C

### Text on the board
tPlace: 1117-33 | 78M05 | 78L12 | GND | +5V | 19200 8N1 | RST | GND | SWC | SWD | 3V3 | RX | +12V | B1 | +3V3 | B2 | TX | B3 | B4 | 32L051C6 | GND | LM358 | K | A | D7 | D6 | 74HCT245 | D5 | D4 | E | RW | RS | V0 | AN | D1_5V | D2_5V | D2_3V3 | D1_3V3 | GND | GND | LCD | +5V
bNames: Signal Generator | v1.0 Jul 2014